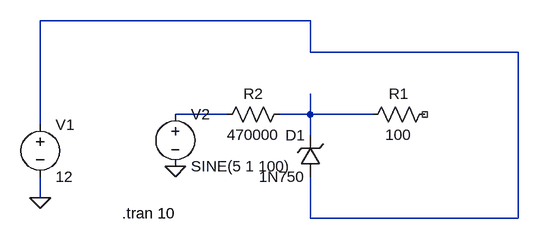
[diagram p0: schematic Draft1.asc]
Draft1.asc, the LTspice schematic file:
Version 4
SHEET 1 880 680
WIRE 224 48 -192 48
WIRE 224 96 224 48
WIRE 544 96 224 96
WIRE 96 192 16 192
WIRE 224 192 224 160
WIRE 224 192 176 192
WIRE 320 192 224 192
WIRE -192 208 -192 48
WIRE 224 224 224 192
WIRE -192 320 -192 288
WIRE 224 352 224 288
WIRE 544 352 544 96
WIRE 544 352 224 352
FLAG -192 320 0
FLAG 16 272 0
SYMBOL zener 240 288 R180
WINDOW 0 24 64 Left 2
WINDOW 3 24 0 Left 2
SYMATTR InstName D1
SYMATTR Value 1N750
SYMATTR Description Diode
SYMATTR Type diode
SYMBOL voltage -192 192 R0
WINDOW 123 0 0 Left 0
WINDOW 39 0 0 Left 0
SYMATTR InstName V1
SYMATTR Value 12
SYMBOL voltage 16 176 R0
WINDOW 123 24 124 Left 2
WINDOW 39 0 0 Left 0
SYMATTR InstName V2
SYMATTR Value SINE(5 1 100)
SYMBOL res 416 176 R90
WINDOW 0 0 56 VBottom 2
WINDOW 3 32 56 VTop 2
SYMATTR InstName R1
SYMATTR Value 100
SYMBOL res 192 176 R90
WINDOW 0 0 56 VBottom 2
WINDOW 3 32 56 VTop 2
SYMATTR InstName R2
SYMATTR Value 470000
TEXT -66 344 Left 2 !.tran 10

The netlist it stands for:
* Draft1.asc
D1 N001 N003 1N750
V1 N001 0 12
V2 N002 0 SINE(5 1 100)
R1 NC_01 N003 100
R2 N003 N002 470000
.model D D
.lib standard.dio
.tran 10
.backanno
.end